# Altium schematic sheet [02] - Microcontroller.SchDoc: Microcontroller
size A3; Date: N.A.; ApprovedBy: N.A.; CheckedBy: N.A.; Author: N.A.; CompanyName: Johannes Berndorfer; DrawnBy: JBE; Organization: N.A.; Address1: Konrad Grefe Gasse 22; Address2: 1230 Wien; Address3: AUSTRIA; Address4: N.A.; DocumentNumber: 2; Revision: A; SheetNumber: 2; SheetTotal: 3; ProjectTitle: IntelliModule-Alpha; Reviewer: -; Time: N.A.; ImagePath: N.A.; Application_BuildNumber: N.A.
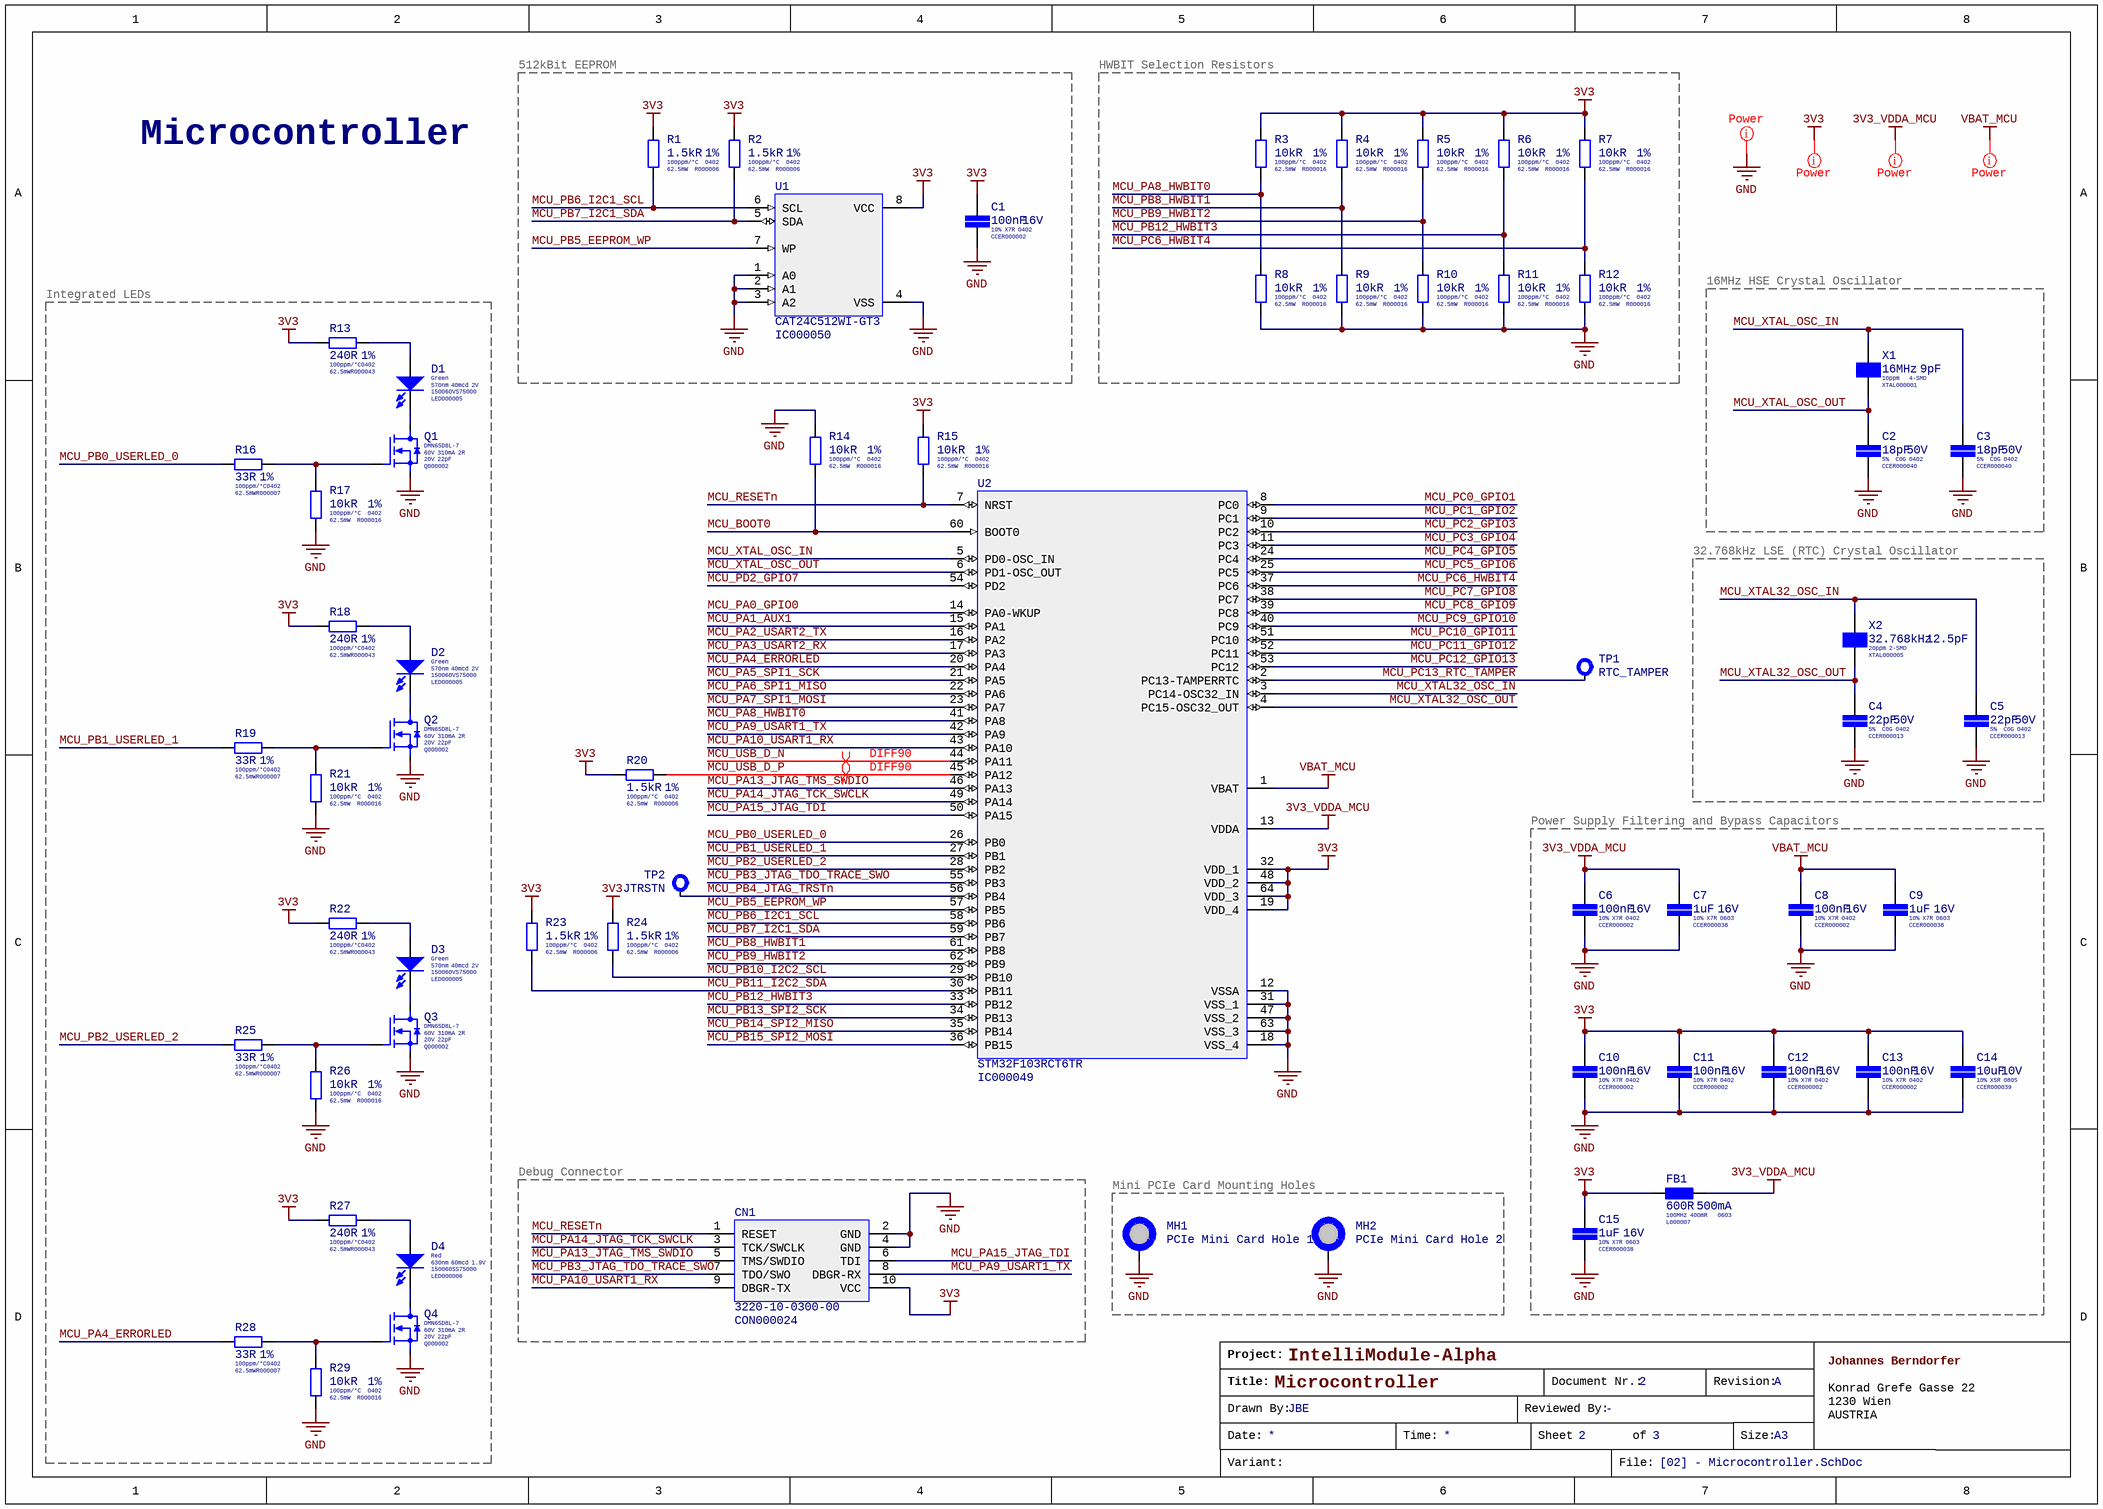
[diagram p0: [02] - Microcontroller.SchDoc]

## Parts
C1  Tolerance: 10%  Internal Part Number: CCER000002  Voltage Rating (DC): 16V  Dielectric: X7R  Case/Package: 0402  Capacitance: 100nF  [CAP-SMD-0402-0.55MM-IPC-MED]  (hidden comment: 100nF 16V)
C2  Internal Part Number: CCER000040  Case/Package: 0402  Dielectric: C0G  Tolerance: 5%  Voltage Rating: 50V  Capacitance: 18pF  [CAP-SMD-0402-0.55MM-IPC-MED]  (hidden comment: 18pF 50V)
C3  Internal Part Number: CCER000040  Case/Package: 0402  Dielectric: C0G  Tolerance: 5%  Voltage Rating: 50V  Capacitance: 18pF  [CAP-SMD-0402-0.55MM-IPC-MED]  (hidden comment: 18pF 50V)
C4  Internal Part Number: CCER000013  Voltage Rating: 50V  Tolerance: 5%  Dielectric: C0G  Case/Package: 0402  Capacitance: 22pF  [CAP-SMD-0402-0.55MM-IPC-MED]  (hidden comment: 22pF 50V)
C5  Internal Part Number: CCER000013  Voltage Rating: 50V  Tolerance: 5%  Dielectric: C0G  Case/Package: 0402  Capacitance: 22pF  [CAP-SMD-0402-0.55MM-IPC-MED]  (hidden comment: 22pF 50V)
C6  Tolerance: 10%  Internal Part Number: CCER000002  Voltage Rating (DC): 16V  Dielectric: X7R  Case/Package: 0402  Capacitance: 100nF  [CAP-SMD-0402-0.55MM-IPC-MED]  (hidden comment: 100nF 16V)
C7  Internal Part Number: CCER000038  Capacitance: 1uF  Voltage: 16V  Tolerance: 10%  Dielectric: X7R  Case/Package: 0603  [CAP-SMD-0603-0.9MM-IPC-MED]  (hidden comment: 1uF 16V)
C8  Tolerance: 10%  Internal Part Number: CCER000002  Voltage Rating (DC): 16V  Dielectric: X7R  Case/Package: 0402  Capacitance: 100nF  [CAP-SMD-0402-0.55MM-IPC-MED]  (hidden comment: 100nF 16V)
C9  Internal Part Number: CCER000038  Capacitance: 1uF  Voltage: 16V  Tolerance: 10%  Dielectric: X7R  Case/Package: 0603  [CAP-SMD-0603-0.9MM-IPC-MED]  (hidden comment: 1uF 16V)
C10  Tolerance: 10%  Internal Part Number: CCER000002  Voltage Rating (DC): 16V  Dielectric: X7R  Case/Package: 0402  Capacitance: 100nF  [CAP-SMD-0402-0.55MM-IPC-MED]  (hidden comment: 100nF 16V)
C11  Tolerance: 10%  Internal Part Number: CCER000002  Voltage Rating (DC): 16V  Dielectric: X7R  Case/Package: 0402  Capacitance: 100nF  [CAP-SMD-0402-0.55MM-IPC-MED]  (hidden comment: 100nF 16V)
C12  Tolerance: 10%  Internal Part Number: CCER000002  Voltage Rating (DC): 16V  Dielectric: X7R  Case/Package: 0402  Capacitance: 100nF  [CAP-SMD-0402-0.55MM-IPC-MED]  (hidden comment: 100nF 16V)
C13  Tolerance: 10%  Internal Part Number: CCER000002  Voltage Rating (DC): 16V  Dielectric: X7R  Case/Package: 0402  Capacitance: 100nF  [CAP-SMD-0402-0.55MM-IPC-MED]  (hidden comment: 100nF 16V)
C14  Internal Part Number: CCER000039  Tolerance: 10%  Voltage Rating: 10V  Dielectric: X5R  Case/Package: 0805  Capacitance: 10uF  [CAP-SMD-0805-1.35MM-IPC-MED]  (hidden comment: 10uF 10V)
C15  Internal Part Number: CCER000038  Capacitance: 1uF  Voltage: 16V  Tolerance: 10%  Dielectric: X7R  Case/Package: 0603  [CAP-SMD-0603-0.9MM-IPC-MED]  (hidden comment: 1uF 16V)
CN1  3220-10-0300-00  Internal Part Number: CON000024  [CON-SMD-PINHEADER-SHIELDED-1.27MM-10POS-2X5-3220-10-0300-00-CNC-TECH]
D1  Luminous Intensity: 40mcd  Forward Voltage: 2V  Color: Green  Wavelength: 570nm  Internal Part Number: LED000005  [LED-SMD-0603]  (hidden comment: 150060VS75000)
D2  Luminous Intensity: 40mcd  Forward Voltage: 2V  Color: Green  Wavelength: 570nm  Internal Part Number: LED000005  [LED-SMD-0603]  (hidden comment: 150060VS75000)
D3  Luminous Intensity: 40mcd  Forward Voltage: 2V  Color: Green  Wavelength: 570nm  Internal Part Number: LED000005  [LED-SMD-0603]  (hidden comment: 150060VS75000)
D4  Internal Part Number: LED000006  Luminous Intensity: 60mcd  Forward Voltage: 1.9V  Dominant Wavelength: 630nm  Color: Red  [LED-SMD-0603]  (hidden comment: 150060SS75000)
FB1  Internal Part Number: L000007  Max DC Current: 500mA  Impedance: 600R  DC Resistance (DCR): 400mR  Case/Package: 0603  [IND-SMD-0603-0.75MM-IPC-MED]  (hidden comment: 600R-100MHz 500MA)
MH1  PCIe Mini Card Hole 1  [MECH-HOLE-PTH-2.6MM-5.8MMSQ-PCIEMINI]
MH2  PCIe Mini Card Hole 2  [MECH-HOLE-PTH-2.6MM-5.8MMSQ-PCIEMINI]
Q1  Drain to Source Resistance: 2R  Continuous Drain Current (ID): 310mA  Drain to Source Breakdown Voltage: 60V  Gate to Source Voltage (Vgs): 20V  Input Capacitance: 22pF  Internal Part Number: Q000002  [SOT-23-3-H1.1MM-DIODES-INC]  (hidden comment: DMN65D8L-7)
Q2  Drain to Source Resistance: 2R  Continuous Drain Current (ID): 310mA  Drain to Source Breakdown Voltage: 60V  Gate to Source Voltage (Vgs): 20V  Input Capacitance: 22pF  Internal Part Number: Q000002  [SOT-23-3-H1.1MM-DIODES-INC]  (hidden comment: DMN65D8L-7)
Q3  Drain to Source Resistance: 2R  Continuous Drain Current (ID): 310mA  Drain to Source Breakdown Voltage: 60V  Gate to Source Voltage (Vgs): 20V  Input Capacitance: 22pF  Internal Part Number: Q000002  [SOT-23-3-H1.1MM-DIODES-INC]  (hidden comment: DMN65D8L-7)
Q4  Drain to Source Resistance: 2R  Continuous Drain Current (ID): 310mA  Drain to Source Breakdown Voltage: 60V  Gate to Source Voltage (Vgs): 20V  Input Capacitance: 22pF  Internal Part Number: Q000002  [SOT-23-3-H1.1MM-DIODES-INC]  (hidden comment: DMN65D8L-7)
R1  Temperature Coefficient: 100ppm/°C  Tolerance: 1%  Resistance: 1.5kR  Max Power Dissipation: 62.5mW  Case/Package: 0402  Internal Part Number: R000006  [RES-SMD-0402-0.4MM-IPC-MED]  (hidden comment: 1.5kR 1%)
R2  Temperature Coefficient: 100ppm/°C  Tolerance: 1%  Resistance: 1.5kR  Max Power Dissipation: 62.5mW  Case/Package: 0402  Internal Part Number: R000006  [RES-SMD-0402-0.4MM-IPC-MED]  (hidden comment: 1.5kR 1%)
R3  Tolerance: 1%  Temperature Coefficient: 100ppm/°C  Resistance: 10kR  Power Rating: 62.5mW  Case Code (Imperial): 0402  Internal Part Number: R000016  [RES-SMD-0402-0.4MM-IPC-MED]  (hidden comment: 10kR 1%)
R4  Tolerance: 1%  Temperature Coefficient: 100ppm/°C  Resistance: 10kR  Power Rating: 62.5mW  Case Code (Imperial): 0402  Internal Part Number: R000016  [RES-SMD-0402-0.4MM-IPC-MED]  (hidden comment: 10kR 1%)
R5  Tolerance: 1%  Temperature Coefficient: 100ppm/°C  Resistance: 10kR  Power Rating: 62.5mW  Case Code (Imperial): 0402  Internal Part Number: R000016  [RES-SMD-0402-0.4MM-IPC-MED]  (hidden comment: 10kR 1%)
R6  Tolerance: 1%  Temperature Coefficient: 100ppm/°C  Resistance: 10kR  Power Rating: 62.5mW  Case Code (Imperial): 0402  Internal Part Number: R000016  [RES-SMD-0402-0.4MM-IPC-MED]  (hidden comment: 10kR 1%)
R7  Tolerance: 1%  Temperature Coefficient: 100ppm/°C  Resistance: 10kR  Power Rating: 62.5mW  Case Code (Imperial): 0402  Internal Part Number: R000016  [RES-SMD-0402-0.4MM-IPC-MED]  (hidden comment: 10kR 1%)
R8  Tolerance: 1%  Temperature Coefficient: 100ppm/°C  Resistance: 10kR  Power Rating: 62.5mW  Case Code (Imperial): 0402  Internal Part Number: R000016  [RES-SMD-0402-0.4MM-IPC-MED]  (hidden comment: 10kR 1%)
R9  Tolerance: 1%  Temperature Coefficient: 100ppm/°C  Resistance: 10kR  Power Rating: 62.5mW  Case Code (Imperial): 0402  Internal Part Number: R000016  [RES-SMD-0402-0.4MM-IPC-MED]  (hidden comment: 10kR 1%)
R10  Tolerance: 1%  Temperature Coefficient: 100ppm/°C  Resistance: 10kR  Power Rating: 62.5mW  Case Code (Imperial): 0402  Internal Part Number: R000016  [RES-SMD-0402-0.4MM-IPC-MED]  (hidden comment: 10kR 1%)
R11  Tolerance: 1%  Temperature Coefficient: 100ppm/°C  Resistance: 10kR  Power Rating: 62.5mW  Case Code (Imperial): 0402  Internal Part Number: R000016  [RES-SMD-0402-0.4MM-IPC-MED]  (hidden comment: 10kR 1%)
R12  Tolerance: 1%  Temperature Coefficient: 100ppm/°C  Resistance: 10kR  Power Rating: 62.5mW  Case Code (Imperial): 0402  Internal Part Number: R000016  [RES-SMD-0402-0.4MM-IPC-MED]  (hidden comment: 10kR 1%)
R13  Resistance: 240R  Tolerance: 1%  Temperature Coefficient: 100ppm/°C  Power Rating: 62.5mW  Case/Package: 0402  Internal Part Number: R000043  [RES-SMD-0402-0.4MM-IPC-MED]  (hidden comment: 240R 1%)
R14  Tolerance: 1%  Temperature Coefficient: 100ppm/°C  Resistance: 10kR  Power Rating: 62.5mW  Case Code (Imperial): 0402  Internal Part Number: R000016  [RES-SMD-0402-0.4MM-IPC-MED]  (hidden comment: 10kR 1%)
R15  Tolerance: 1%  Temperature Coefficient: 100ppm/°C  Resistance: 10kR  Power Rating: 62.5mW  Case Code (Imperial): 0402  Internal Part Number: R000016  [RES-SMD-0402-0.4MM-IPC-MED]  (hidden comment: 10kR 1%)
R16  Internal Part Number: R000007  Temperature Coefficient: 100ppm/°C  Case/Package: 0402  Power Rating: 62.5mW  Tolerance: 1%  Resistance: 33R  [RES-SMD-0402-0.4MM-IPC-MED]  (hidden comment: 33R 1%)
R17  Tolerance: 1%  Temperature Coefficient: 100ppm/°C  Resistance: 10kR  Power Rating: 62.5mW  Case Code (Imperial): 0402  Internal Part Number: R000016  [RES-SMD-0402-0.4MM-IPC-MED]  (hidden comment: 10kR 1%)
R18  Resistance: 240R  Tolerance: 1%  Temperature Coefficient: 100ppm/°C  Power Rating: 62.5mW  Case/Package: 0402  Internal Part Number: R000043  [RES-SMD-0402-0.4MM-IPC-MED]  (hidden comment: 240R 1%)
R19  Internal Part Number: R000007  Temperature Coefficient: 100ppm/°C  Case/Package: 0402  Power Rating: 62.5mW  Tolerance: 1%  Resistance: 33R  [RES-SMD-0402-0.4MM-IPC-MED]  (hidden comment: 33R 1%)
R20  Temperature Coefficient: 100ppm/°C  Tolerance: 1%  Resistance: 1.5kR  Max Power Dissipation: 62.5mW  Case/Package: 0402  Internal Part Number: R000006  [RES-SMD-0402-0.4MM-IPC-MED]  (hidden comment: 1.5kR 1%)
R21  Tolerance: 1%  Temperature Coefficient: 100ppm/°C  Resistance: 10kR  Power Rating: 62.5mW  Case Code (Imperial): 0402  Internal Part Number: R000016  [RES-SMD-0402-0.4MM-IPC-MED]  (hidden comment: 10kR 1%)
R22  Resistance: 240R  Tolerance: 1%  Temperature Coefficient: 100ppm/°C  Power Rating: 62.5mW  Case/Package: 0402  Internal Part Number: R000043  [RES-SMD-0402-0.4MM-IPC-MED]  (hidden comment: 240R 1%)
R23  Temperature Coefficient: 100ppm/°C  Tolerance: 1%  Resistance: 1.5kR  Max Power Dissipation: 62.5mW  Case/Package: 0402  Internal Part Number: R000006  [RES-SMD-0402-0.4MM-IPC-MED]  (hidden comment: 1.5kR 1%)
R24  Temperature Coefficient: 100ppm/°C  Tolerance: 1%  Resistance: 1.5kR  Max Power Dissipation: 62.5mW  Case/Package: 0402  Internal Part Number: R000006  [RES-SMD-0402-0.4MM-IPC-MED]  (hidden comment: 1.5kR 1%)
R25  Internal Part Number: R000007  Temperature Coefficient: 100ppm/°C  Case/Package: 0402  Power Rating: 62.5mW  Tolerance: 1%  Resistance: 33R  [RES-SMD-0402-0.4MM-IPC-MED]  (hidden comment: 33R 1%)
R26  Tolerance: 1%  Temperature Coefficient: 100ppm/°C  Resistance: 10kR  Power Rating: 62.5mW  Case Code (Imperial): 0402  Internal Part Number: R000016  [RES-SMD-0402-0.4MM-IPC-MED]  (hidden comment: 10kR 1%)
R27  Resistance: 240R  Tolerance: 1%  Temperature Coefficient: 100ppm/°C  Power Rating: 62.5mW  Case/Package: 0402  Internal Part Number: R000043  [RES-SMD-0402-0.4MM-IPC-MED]  (hidden comment: 240R 1%)
R28  Internal Part Number: R000007  Temperature Coefficient: 100ppm/°C  Case/Package: 0402  Power Rating: 62.5mW  Tolerance: 1%  Resistance: 33R  [RES-SMD-0402-0.4MM-IPC-MED]  (hidden comment: 33R 1%)
R29  Tolerance: 1%  Temperature Coefficient: 100ppm/°C  Resistance: 10kR  Power Rating: 62.5mW  Case Code (Imperial): 0402  Internal Part Number: R000016  [RES-SMD-0402-0.4MM-IPC-MED]  (hidden comment: 10kR 1%)
TP1  RTC_TAMPER  [TP-SMD-CIRCULAR-0.5MM]
TP2  JTRSTN  [TP-SMD-CIRCULAR-0.5MM]
U1  CAT24C512WI-GT3  Internal Part Number: IC000050  [SOIC-8-H1.75MM-P1.27MM-ONSEMI]
U2  STM32F103RCT6TR  Internal Part Number: IC000049  [LQFP-64-10X10MM-H1.6MM-P0.5MM-ST]
X1  Case/Package: 4-SMD  Internal Part Number: XTAL000001  Frequency Tolerance: 10ppm  Load Capacitance: 9pF  Frequency: 16MHz  [XTAL-SMD-4-SMD-3.2X2.5MM]  (hidden comment: 16MHz 9pF)
X2  Internal Part Number: XTAL000005  Case/Package: 2-SMD  Frequency Tolerance: 20ppm  Load Capacitance: 12.5pF  Frequency: 32.768kHz  [XTAL-SMD-2-SMD-3.2X1.5MM]  (hidden comment: 32.768kHz 12.5pF)

## Blocks framed on the sheet
512kBit EEPROM: C1 R1 R2 U1
HWBIT Selection Resistors: R3-R12
Integrated LEDs: D1-D4 Q1-Q4 R13 R16-R19 R21 R22 R25-R29
16MHz HSE Crystal Oscillator: C2 C3 X1
32.768kHz LSE (RTC) Crystal Oscillator: C4 C5 X2
Power Supply Filtering and Bypass Capacitors: C6-C15 FB1
Debug Connector: CN1
Mini PCIe Card Mounting Holes: MH1 MH2

## Nets
3V3: C1.1 C10.1 C11.1 C12.1 C13.1 C14.1 C15.1 CN1.10(VCC) FB1.1 R1.1 R2.1 R3.1 R4.1 R5.1 R6.1 R7.1 R13.1 R15.1 R18.1 R20.1 R22.1 R23.1 R24.1 R27.1 U1.8(VCC) U2.19(VDD_4) U2.32(VDD_1) U2.48(VDD_2) U2.64(VDD_3)
3V3_VDDA_MCU: C6.1 C7.1 FB1.2 U2.13(VDDA)
GND: C1.2 C2.2 C3.2 C4.2 C5.2 C6.2 C7.2 C8.2 C9.2 C10.2 C11.2 C12.2 C13.2 C14.2 C15.2 CN1.2(GND) CN1.4(GND) MH1.1 MH2.1 Q1.2(Source) Q2.2(Source) Q3.2(Source) Q4.2(Source) R8.2 R9.2 R10.2 R11.2 R12.2 R14.1 R17.2 R21.2 R26.2 R29.2 U1.1(A0) U1.2(A1) U1.3(A2) U1.4(VSS) U2.12(VSSA) U2.18(VSS_4) U2.31(VSS_1) U2.47(VSS_2) U2.63(VSS_3)
VBAT_MCU: C8.1 C9.1 U2.1(VBAT)
MCU_BOOT0: R14.2 U2.60(BOOT0)
MCU_PA0_GPIO0: U2.14(PA0-WKUP)
MCU_PA1_AUX1: U2.15(PA1)
MCU_PA2_USART2_TX: U2.16(PA2)
MCU_PA3_USART2_RX: U2.17(PA3)
MCU_PA4_ERRORLED: R28.1 U2.20(PA4)
MCU_PA5_SPI1_SCK: U2.21(PA5)
MCU_PA6_SPI1_MISO: U2.22(PA6)
MCU_PA7_SPI1_MOSI: U2.23(PA7)
MCU_PA8_HWBIT0: R3.2 R8.1 U2.41(PA8)
MCU_PA9_USART1_TX: CN1.8(DBGR-RX) U2.42(PA9)
MCU_PA10_USART1_RX: CN1.9(DBGR-TX) U2.43(PA10)
MCU_PA13_JTAG_TMS_SWDIO: CN1.5(TMS/SWDIO) U2.46(PA13)
MCU_PA14_JTAG_TCK_SWCLK: CN1.3(TCK/SWCLK) U2.49(PA14)
MCU_PA15_JTAG_TDI: CN1.6(TDI) U2.50(PA15)
MCU_PB0_USERLED_0: R16.1 U2.26(PB0)
MCU_PB1_USERLED_1: R19.1 U2.27(PB1)
MCU_PB2_USERLED_2: R25.1 U2.28(PB2)
MCU_PB3_JTAG_TDO_TRACE_SWO: CN1.7(TDO/SWO) U2.55(PB3)
MCU_PB4_JTAG_TRSTn: TP2.1 U2.56(PB4)
MCU_PB5_EEPROM_WP: U1.7(WP) U2.57(PB5)
MCU_PB6_I2C1_SCL: R1.2 U1.6(SCL) U2.58(PB6)
MCU_PB7_I2C1_SDA: R2.2 U1.5(SDA) U2.59(PB7)
MCU_PB8_HWBIT1: R4.2 R9.1 U2.61(PB8)
MCU_PB9_HWBIT2: R5.2 R10.1 U2.62(PB9)
MCU_PB10_I2C2_SCL: R24.2 U2.29(PB10)
MCU_PB11_I2C2_SDA: R23.2 U2.30(PB11)
MCU_PB12_HWBIT3: R6.2 R11.1 U2.33(PB12)
MCU_PB13_SPI2_SCK: U2.34(PB13)
MCU_PB14_SPI2_MISO: U2.35(PB14)
MCU_PB15_SPI2_MOSI: U2.36(PB15)
MCU_PC0_GPIO1: U2.8(PC0)
MCU_PC1_GPIO2: U2.9(PC1)
MCU_PC2_GPIO3: U2.10(PC2)
MCU_PC3_GPIO4: U2.11(PC3)
MCU_PC4_GPIO5: U2.24(PC4)
MCU_PC5_GPIO6: U2.25(PC5)
MCU_PC6_HWBIT4: R7.2 R12.1 U2.37(PC6)
MCU_PC7_GPIO8: U2.38(PC7)
MCU_PC8_GPIO9: U2.39(PC8)
MCU_PC9_GPIO10: U2.40(PC9)
MCU_PC10_GPIO11: U2.51(PC10)
MCU_PC11_GPIO12: U2.52(PC11)
MCU_PC12_GPIO13: U2.53(PC12)
MCU_PC13_RTC_TAMPER: TP1.1 U2.2(PC13-TAMPERRTC)
MCU_PD2_GPIO7: U2.54(PD2)
MCU_RESETn: CN1.1(RESET) R15.2 U2.7(NRST)
MCU_USB_D_N: U2.44(PA11)
MCU_USB_D_P: R20.2 U2.45(PA12)
MCU_XTAL32_OSC_IN: C5.1 U2.3(PC14-OSC32_IN) X2.1
MCU_XTAL32_OSC_OUT: C4.1 U2.4(PC15-OSC32_OUT) X2.2
MCU_XTAL_OSC_IN: C3.1 U2.5(PD0-OSC_IN) X1.1
MCU_XTAL_OSC_OUT: C2.1 U2.6(PD1-OSC_OUT) X1.3
NetD1_1: D1.1 Q1.3(Drain)
NetD1_2: D1.2 R13.2
NetD2_1: D2.1 Q2.3(Drain)
NetD2_2: D2.2 R18.2
NetD3_1: D3.1 Q3.3(Drain)
NetD3_2: D3.2 R22.2
NetD4_1: D4.1 Q4.3(Drain)
NetD4_2: D4.2 R27.2
NetQ1_1: Q1.1(Gate) R16.2 R17.1
NetQ2_1: Q2.1(Gate) R19.2 R21.1
NetQ3_1: Q3.1(Gate) R25.2 R26.1
NetQ4_1: Q4.1(Gate) R28.2 R29.1

## Layout directives
differential pair; differential pair class DIFF90: MCU_USB_D_N, MCU_USB_D_P
net class Power: 3V3, 3V3_VDDA_MCU, GND, VBAT_MCU

## Notes on the sheet
- Labels drawn without touching a wire or pin: 3V3, 3V3_VDDA_MCU, GND, VBAT_MCU
- Title:
- Project:
- Document Nr.:
- Revision:
- Date:
- Drawn By:
- Time:
- Reviewed By:
- Sheet
- of
- Size:
- A3
- Variant:
- File:
- (in symbol MMZ1608B601CTAH0) 100MHz

## Library data of the parts
C1 C6 C8 C10-C13 = CL05B104KO5NNNC: CAP CER 100N 16V X7R 10% SMD 0402 125C SAMSUNG; Material: Ceramic; Supplier 1: Digi-Key; Manufacturer 1: Samsung; Manufacturer Part Number 1: CL05B104KO5NNNC; Stock 1: 53930414; Pricing 1: 1=0,10000, 10=0,02400, 100=0,01070, 500=0,00766, 1000=0,00602, 2500=0,00548, 5000=0,00504 (USD); RoHS: Yes; Mount: Surface Mount; Case Code (Metric): 1005; Case Code (Imperial): 0402; Contact Plating: Tin; Min Operating Temperature: -55°C; Max Operating Temperature: 125°C; Package Quantity: 1; Packaging: Tape and Reel; Voltage Rating: 16V; Voltage: 16V; Length: 1mm; Height: 0.5mm; Width: 0.02inch; Thickness: 0.022inch; Depth: 0.5mm; Radiation Hardening: No; Lead Free: Lead Free; ComponentLink1URL: https://datasheet.ciiva.com/26920/getdatasheetpartid-359683-26920169.pdf?src-supplier=Verical; ComponentLink1Description: https://datasheet.ciiva.com/26920/getdatasheetpartid-359683-26920169.pdf?src-supplier=Verical; ComponentLink2URL: https://datasheet.ciiva.com/29198/458718-da-01-en-vs-kondensator-0402-29198423.pdf?src-supplier=Conrad; ComponentLink2Description: https://datasheet.ciiva.com/29198/458718-da-01-en-vs-kondensator-0402-29198423.pdf?src-supplier=Conrad; ComponentLink3URL: https://datasheet.ciiva.com/16208/cl05b104kq5nnnc-16208343.pdf?src-supplier=Future+Electronics; ComponentLink3Description: https://datasheet.ciiva.com/16208/cl05b104kq5nnnc-16208343.pdf?src-supplier=Future+Electronics; ComponentLink4URL: https://datasheet.ciiva.com/26309/mlcc-catalogdownload2013-eng-26309003.pdf?src-supplier=Distrelec; ComponentLink4Description: https://datasheet.ciiva.com/26309/mlcc-catalogdownload2013-eng-26309003.pdf?src-supplier=Distrelec; Supplier Part Number 1: 1276-1001-6-ND
C2 C3 = CC0402JRNPO9BN180: CAP CER 18P 50V C0G 5% SMD 0402 125C YAGEO; Temperature Coefficient: 30ppm/°C; Supplier 1: Digi-Key; Manufacturer 1: Yageo; Manufacturer Part Number 1: CC0402JRNPO9BN180; Stock 1: 608594; Pricing 1: 1=0,10000, 10=0,02400, 100=0,01070, 500=0,00764, 1000=0,00601, 2500=0,00546, 5000=0,00502 (USD); RoHS: Yes; Mount: Surface Mount; Number of Pins: 2; Weight: 2.3E-05oz; Case Code (Metric): 1005; Case Code (Imperial): 0402; Min Operating Temperature: -55°C; Max Operating Temperature: 125°C; Packaging: Tape and Reel; Package Quantity: 1; Voltage Rating (DC): 50V; Termination: SMD/SMT; Composition: Ceramic; Voltage: 50V; Length: 1mm; Height: 0.5mm; Width: 0.02inch; Thickness: 0.022inch; Depth: 0.5mm; Radiation Hardening: No; REACH SVHC: No SVHC; Lead Free: Lead Free; ComponentLink1URL: https://datasheet.ciiva.com/11788/0900766b80d84fbf-11788369.pdf?src-supplier=RSComponents; ComponentLink1Description: https://datasheet.ciiva.com/11788/0900766b80d84fbf-11788369.pdf?src-supplier=RSComponents; ComponentLink2URL: https://datasheet.ciiva.com/176/mlccorderingcode-176358.pdf?src-supplier=Digi-Key; ComponentLink2Description: https://datasheet.ciiva.com/176/mlccorderingcode-176358.pdf?src-supplier=Digi-Key; ComponentLink3URL: https://datasheet.ciiva.com/176/mlccorderingcode-176359.pdf?src-supplier=Digi-Key; ComponentLink3Description: https://datasheet.ciiva.com/176/mlccorderingcode-176359.pdf?src-supplier=Digi-Key; ComponentLink4URL: https://datasheet.ciiva.com/11587/upy-gp-np0-16v-to-50v-8-11587087.pdf?src-supplier=Avnet; ComponentLink4Description: https://datasheet.ciiva.com/11587/upy-gp-np0-16v-to-50v-8-11587087.pdf?src-supplier=Avnet; ComponentLink5URL: https://datasheet.ciiva.com/176/mlccorderingcode-176357.pdf?src-supplier=Digi-Key; ComponentLink5Description: https://datasheet.ciiva.com/176/mlccorderingcode-176357.pdf?src-supplier=Digi-Key; ComponentLink6URL: https://datasheet.ciiva.com/28450/1443161-28450232.pdf?src-supplier=Element14; ComponentLink6Description: https://datasheet.ciiva.com/28450/1443161-28450232.pdf?src-supplier=Element14; ComponentLink7URL: https://datasheet.ciiva.com/13208/upy-gp-np0-16v-to-50v-8-13208430.pdf?src-supplier=Mouser; ComponentLink7Description: https://datasheet.ciiva.com/13208/upy-gp-np0-16v-to-50v-8-13208430.pdf?src-supplier=Mouser; Supplier Part Number 1: 311-1415-1-ND
C4 C5 = CL05C220JB5NNNC: CAP CER 22P 50V C0G 5% SMD 0402 125C SAMSUNG; Material: Ceramic; Temperature Coefficient: 300ppm/°C; Supplier 1: Digi-Key; Manufacturer: Samsung; Manufacturer Part Number: CL05C220JB5NNNC; Stock 1: 1663917; Pricing 1: 1 = 0,10000, 10 = 0,03300, 100 = 0,01480, 500 = 0,01058, 1000 = 0,00831, 2500 = 0,00755, 5000 = 0,00695 (USD); RoHS: Yes; Mount: Surface Mount; Case Code (Metric): 1005; Case Code (Imperial): 0402; Contact Plating: Tin; Min Operating Temperature: -55°C; Max Operating Temperature: 125°C; Package Quantity: 1; Packaging: Tape and Reel; Voltage: 50V; Length: 1mm; Height: 0.5mm; Width: 0.02inch; Thickness: 0.022inch; Depth: 0.5mm; Radiation Hardening: No; ComponentLink1URL: https://datasheet.ciiva.com/15195/getdatasheetpartid-358448-15195679.pdf?src-supplier=Verical; ComponentLink1Description: https://datasheet.ciiva.com/15195/getdatasheetpartid-358448-15195679.pdf?src-supplier=Verical; ComponentLink2URL: https://datasheet.ciiva.com/29198/458663-da-01-en-vs-kondensator-0402-29198414.pdf?src-supplier=Conrad; ComponentLink2Description: https://datasheet.ciiva.com/29198/458663-da-01-en-vs-kondensator-0402-29198414.pdf?src-supplier=Conrad; ComponentLink3URL: https://datasheet.ciiva.com/16199/cl05b104kq5nnnc-16199080.pdf?src-supplier=Future+Electronics; ComponentLink3Description: https://datasheet.ciiva.com/16199/cl05b104kq5nnnc-16199080.pdf?src-supplier=Future+Electronics; ComponentLink4URL: https://datasheet.ciiva.com/26309/mlcc-catalogdownload2013-eng-26309032.pdf?src-supplier=Distrelec; ComponentLink4Description: https://datasheet.ciiva.com/26309/mlcc-catalogdownload2013-eng-26309032.pdf?src-supplier=Distrelec; Supplier Part Number 1: 1276-1116-1-ND
C7 C9 C15 = CL10B105KO8NNNC: CAP CER 1U 16V X7R 10% SMD 0603 125C SAMSUNG; Material: Ceramic; Supplier 1: Digi-Key; Manufacturer 1: Samsung; Manufacturer Part Number 1: CL10B105KO8NNNC; Stock 1: 4308120; Pricing 1: 1=0,10000, 10=0,05200, 100=0,02320, 500=0,01654, 1000=0,01300 (USD); RoHS: Yes; Mount: Surface Mount; Case Code (Metric): 1608; Case Code (Imperial): 0603; Min Operating Temperature: -55°C; Max Operating Temperature: 125°C; Packaging: Tape and Reel; Voltage Rating: 16V; Voltage Rating (DC): 16V; Length: 1.6mm; Height: 0.8mm; Width: 0.031inch; Thickness: 0.035inch; Depth: 0.8mm; Radiation Hardening: No; Lead Free: Lead Free; ComponentLink1URL: https://datasheet.ciiva.com/15195/getdatasheetpartid-357418-15195728.pdf?src-supplier=Verical; ComponentLink1Description: https://datasheet.ciiva.com/15195/getdatasheetpartid-357418-15195728.pdf?src-supplier=Verical; ComponentLink2URL: https://datasheet.ciiva.com/29198/458176-da-01-en-vs-kondensator-0603-29198478.pdf?src-supplier=Conrad; ComponentLink2Description: https://datasheet.ciiva.com/29198/458176-da-01-en-vs-kondensator-0603-29198478.pdf?src-supplier=Conrad; Supplier Part Number 1: 1276-1019-1-ND
C14 = CL21A106KPFNNNG: CAP CER 10U 10V X5R 10% SMD 0805 85C SAMSUNG; Supplier 1: Digi-Key; Manufacturer 1: Samsung; Manufacturer Part Number 1: CL21A106KPFNNNG; Stock 1: 884042; Pricing 1: 1=0,14000, 10=0,10000, 100=0,04690, 500=0,03290, 1000=0,02724 (USD); RoHS: Yes; Mount: Surface Mount; Case Code (Metric): 2012; Case Code (Imperial): 0805; Min Operating Temperature: -55°C; Max Operating Temperature: 85°C; Voltage: 10V; Packaging: Tape and Reel; Package Quantity: 3000; Termination: Wraparound; Length: 2mm; Height: 1.25mm; Depth: 1.25mm; Width: 0.049inch; Thickness: 0.053inch; Radiation Hardening: No; Lead Free: Lead Free; ComponentLink1URL: https://datasheet.ciiva.com/16428/cl21a106kpfnnng-16428896.pdf?src-supplier=Future+Electronics; ComponentLink1Description: https://datasheet.ciiva.com/16428/cl21a106kpfnnng-16428896.pdf?src-supplier=Future+Electronics; ComponentLink2URL: https://datasheet.ciiva.com/26936/getdatasheetpartid-640497-26936900.pdf?src-supplier=Verical; ComponentLink2Description: https://datasheet.ciiva.com/26936/getdatasheetpartid-640497-26936900.pdf?src-supplier=Verical; Supplier Part Number 1: 1276-6456-1-ND
CN1 = 3220-10-0300-00: CON PINHDR SMD 1.27MM SHIELDED KEYED CNC TECH 10POS; Number of Positions: 10; Connector Type: Male Pin; Pitch: 0.05inch; Supplier 1: Digi-Key; Manufacturer 1: CNC Tech; Manufacturer Part Number 1: 3220-10-0300-00; Stock 1: 107713; Pricing 1: 1=0,74000, 10=0,69000, 100=0,52900, 500=0,46000, 3200=0,34500, 6400=0,33350, 12800=0,30590 (USD); RoHS: Yes; Mount: Surface Mount; Contact Plating: Gold; Package Quantity: 3200; Number of Rows: 2; Packaging: Tray; Termination: Solder; Row Spacing: 0.05inch; ComponentLink1URL: https://datasheet.ciiva.com/18655/3220-xx-0300-00-18655365.pdf?src-supplier=Digi-Key; ComponentLink1Description: https://datasheet.ciiva.com/18655/3220-xx-0300-00-18655365.pdf?src-supplier=Digi-Key; Supplier Part Number 1: 1175-1629-ND
D1-D3 = 150060VS75000: LED GREEN570NM SMD 0603 2V 20mA 40mcd; Manufacturer: Wurth Electronics; Viewing Angle: 140°; Lens Style: Clear,Rectangular; Forward Current: 30mA; Supplier 1: Digi-Key; Stock 1: 94015; Pricing 1: 1 = 0,14000, 50 = 0,12900, 100 = 0,11000, 500 = 0,09500 (USD); RoHS: Yes; Mount: Surface Mount; Case/Package: 0603; Number of Pins: 2; Case Code (Metric): 1608; Case Code (Imperial): 0603; Min Operating Temperature: -40°C; Max Operating Temperature: 85°C; Package Quantity: 1; Packaging: Tape and Reel; Dominant Wavelength: 570nm; Test Current: 20mA; Length: 1.6mm; Height: 0.7mm; Width: 0.8mm; REACH SVHC: Unknown; ComponentLink1URL: https://datasheet.ciiva.com/23843/150060vs75000-23843249.pdf?src-supplier=Newark; ComponentLink1Description: https://datasheet.ciiva.com/23843/150060vs75000-23843249.pdf?src-supplier=Newark; ComponentLink2URL: https://datasheet.ciiva.com/29279/759431-da-01-en-chipled-0603-w-kl-h-gruen-150060vs7500-29279199.pdf?src-supplier=Conrad; ComponentLink2Description: https://datasheet.ciiva.com/29279/759431-da-01-en-chipled-0603-w-kl-h-gruen-150060vs7500-29279199.pdf?src-supplier=Conrad; ComponentLink3URL: https://datasheet.ciiva.com/29562/150060vs75000-29562919.pdf?src-supplier=Digi-Key; ComponentLink3Description: https://datasheet.ciiva.com/29562/150060vs75000-29562919.pdf?src-supplier=Digi-Key; ComponentLink4URL: https://datasheet.ciiva.com/29562/150060vs75000-29562920.pdf?src-supplier=Digi-Key; ComponentLink4Description: https://datasheet.ciiva.com/29562/150060vs75000-29562920.pdf?src-supplier=Digi-Key; ComponentLink5URL: https://datasheet.ciiva.com/29562/150060vs75000-29562921.pdf?src-supplier=Digi-Key; ComponentLink5Description: https://datasheet.ciiva.com/29562/150060vs75000-29562921.pdf?src-supplier=Digi-Key; ComponentLink6URL: https://datasheet.ciiva.com/48430/150060vs75000-eng-tds-48430043.pdf?src-supplier=Distrelec; ComponentLink6Description: https://datasheet.ciiva.com/48430/150060vs75000-eng-tds-48430043.pdf?src-supplier=Distrelec; Supplier Part Number 1: 732-4980-1-ND; Manufacturer Part Number: 150060VS75000
D4 = 150060SS75000: LED RED630NM SMD 0603 1V9 20mA 60mcd; Manufacturer: Wurth Electronics; Viewing Angle: 140°; Lens Style: Clear,Rectangular; Forward Current: 30mA; Supplier 1: Digi-Key; Stock 1: 15803; Pricing 1: 1 = 0,14000, 50 = 0,12900, 100 = 0,11000, 500 = 0,09500 (USD); RoHS: Yes; Mount: Surface Mount; Case/Package: 0603; Case Code (Metric): 1608; Case Code (Imperial): 0603; Min Operating Temperature: -40°C; Max Operating Temperature: 85°C; Package Quantity: 4000; Packaging: Tape and Reel; Wavelength: 630nm; Test Current: 20mA; Length: 1.6mm; Height: 0.7mm; Width: 0.8mm; REACH SVHC: Unknown; ComponentLink1URL: https://datasheet.ciiva.com/23843/150060ss75000-23843248.pdf?src-supplier=Newark; ComponentLink1Description: https://datasheet.ciiva.com/23843/150060ss75000-23843248.pdf?src-supplier=Newark; ComponentLink2URL: https://datasheet.ciiva.com/29279/759429-da-01-en-chipled-0603-w-kl-s-rot-150060ss75000-29279208.pdf?src-supplier=Conrad; ComponentLink2Description: https://datasheet.ciiva.com/29279/759429-da-01-en-chipled-0603-w-kl-s-rot-150060ss75000-29279208.pdf?src-supplier=Conrad; ComponentLink3URL: https://datasheet.ciiva.com/48430/150060ss75000-eng-tds-48430042.pdf?src-supplier=Distrelec; ComponentLink3Description: https://datasheet.ciiva.com/48430/150060ss75000-eng-tds-48430042.pdf?src-supplier=Distrelec; Supplier Part Number 1: 732-4979-1-ND; Manufacturer Part Number: 150060SS75000
FB1 = MMZ1608B601CTAH0: BEAD 600R@100MHZ 500MA 400mR SMD 0603 FERRITE TDK; Tolerance: 25%; Supplier 1: Digi-Key; Manufacturer 1: TDK; Manufacturer Part Number 1: MMZ1608B601CTAH0; Stock 1: 181107; Pricing 1: 1=0,10000, 10=0,07300, 25=0,06600, 50=0,05940, 100=0,04360, 250=0,03168, 500=0,02904, 1000=0,02508 (USD); RoHS: Yes; Mount: Surface Mount; Core Material: Ferrite; Case Code (Metric): 1608; Case Code (Imperial): 0603; Package Quantity: 1; Packaging: Cut Tape; Length: 0.063inch; Height: 0.03inch; Width: 0.031inch; Depth: 0.8mm; REACH SVHC: No SVHC; ComponentLink1URL: https://datasheet.ciiva.com/46381/714910-46381640.pdf?src-supplier=Element14; ComponentLink1Description: https://datasheet.ciiva.com/46381/714910-46381640.pdf?src-supplier=Element14; ComponentLink2URL: https://datasheet.ciiva.com/46634/beads-commercial-signal-mmz-en-46634744.pdf?src-supplier=Digi-Key; ComponentLink2Description: https://datasheet.ciiva.com/46634/beads-commercial-signal-mmz-en-46634744.pdf?src-supplier=Digi-Key; ComponentLink3URL: https://datasheet.ciiva.com/46634/beads-commercial-signal-mmz-en-46634701.pdf?src-supplier=Digi-Key; ComponentLink3Description: https://datasheet.ciiva.com/46634/beads-commercial-signal-mmz-en-46634701.pdf?src-supplier=Digi-Key; ComponentLink4URL: https://datasheet.ciiva.com/46381/1795294-46381695.pdf?src-supplier=Element14; ComponentLink4Description: https://datasheet.ciiva.com/46381/1795294-46381695.pdf?src-supplier=Element14; Supplier Part Number 1: 445-2166-1-ND; Current Rating: 500mA
MH1 MH2 = MECH-HOLE-PTH-2.6MM-5.8MMSQ-PCIEMINI: 2.6mm Diameter 5.8mm Square Pad Plated Through Hole for PCIe-Mini Cards
Q1-Q4 = DMN65D8L-7: TRANSISTOR MOSFET N-CH 60V 310mA 2R SOT-23; Manufacturer: Diodes; Rise Time: 2.8ns; Rds On Max: 3R; Max Power Dissipation: 370mW; Power Dissipation: 540mW; Turn-Off Delay Time: 12.6ns; Turn-On Delay Time: 2.7ns; Number of Elements: 1; Threshold Voltage: 2V; Element Configuration: Single; FET Type: 1 N-Channel; Supplier 1: Digi-Key; Stock 1: 1242871; Pricing 1: 1 = 0,17000, 10 = 0,15400, 100 = 0,08390, 500 = 0,05166, 1000 = 0,03522 (USD); RoHS: Yes; Mount: Surface Mount; Case/Package: SOT-23; Number of Pins: 3; Weight: 0.000282oz; Min Operating Temperature: -55°C; Max Operating Temperature: 150°C; Packaging: Tape and Reel; Package Quantity: 1; Drain to Source Voltage (Vdss): 60V; Number of Channels: 1; Length: 3mm; Height: 1.1mm; Width: 1.4mm; REACH SVHC: No SVHC; Lead Free: Lead Free; ComponentLink1URL: https://datasheet.ciiva.com/6371/dmn65d8l-6371124.pdf?src-supplier=Digi-Key; ComponentLink1Description: https://datasheet.ciiva.com/6371/dmn65d8l-6371124.pdf?src-supplier=Digi-Key; ComponentLink2URL: https://datasheet.ciiva.com/13058/dmn65d8l-219098-13058455.pdf?src-supplier=Mouser; ComponentLink2Description: https://datasheet.ciiva.com/13058/dmn65d8l-219098-13058455.pdf?src-supplier=Mouser; ComponentLink3URL: https://datasheet.ciiva.com/6371/dmn65d8l-6371126.pdf?src-supplier=Digi-Key; ComponentLink3Description: https://datasheet.ciiva.com/6371/dmn65d8l-6371126.pdf?src-supplier=Digi-Key; ComponentLink4URL: https://datasheet.ciiva.com/6371/dmn65d8l-6371128.pdf?src-supplier=Digi-Key; ComponentLink4Description: https://datasheet.ciiva.com/6371/dmn65d8l-6371128.pdf?src-supplier=Digi-Key; Supplier Part Number 1: DMN65D8L-7DICT-ND; Manufacturer Part Number: DMN65D8L-7
R1 R2 R20 R23 R24 = RC0402FR-071K5L: RES 1K5 1% 1/16W SMD 0402 YAEGO; Manufacturer: Yageo; Voltage Rating: 50V; Supplier 1: Digi-Key; Manufacturer Part Number: RC0402FR-071K5L; Stock 1: 9091318; Pricing 1: 1 = 0,10000, 10 = 0,01600, 100 = 0,00640, 1000 = 0,00286, 2500 = 0,00248, 5000 = 0,00205 (USD); RoHS: Yes; Case Code (Metric): 1005; Case Code (Imperial): 0402; Min Operating Temperature: -55°C; Max Operating Temperature: 155°C; Package Quantity: 1; Power Rating: 62.5mW; Packaging: Tape and Reel; Composition: Thick Film; Number of Terminations: 2; Termination: SMD/SMT; Military Standard: Not; Features: Moisture Resistant; Length: 1mm; Height: 0.016inch; Width: 0.02inch; Depth: 0.5mm; REACH SVHC: No SVHC; Lead Free: Lead Free; ComponentLink1URL: https://datasheet.ciiva.com/11808/0900766b80c66297-11808238.pdf?src-supplier=RSComponents; ComponentLink1Description: https://datasheet.ciiva.com/11808/0900766b80c66297-11808238.pdf?src-supplier=RSComponents; ComponentLink2URL: https://datasheet.ciiva.com/2453/pyu-r-int-thick-7-2453440.pdf?src-supplier=Digi-Key; ComponentLink2Description: https://datasheet.ciiva.com/2453/pyu-r-int-thick-7-2453440.pdf?src-supplier=Digi-Key; ComponentLink3URL: https://datasheet.ciiva.com/2453/pyu-r-int-thick-7-2453441.pdf?src-supplier=Digi-Key; ComponentLink3Description: https://datasheet.ciiva.com/2453/pyu-r-int-thick-7-2453441.pdf?src-supplier=Digi-Key; ComponentLink4URL: https://datasheet.ciiva.com/46394/1018594-46394950.pdf?src-supplier=Element14; ComponentLink4Description: https://datasheet.ciiva.com/46394/1018594-46394950.pdf?src-supplier=Element14; ComponentLink5URL: https://datasheet.ciiva.com/7849/1018594-7849864.pdf?src-supplier=Element14; ComponentLink5Description: https://datasheet.ciiva.com/7849/1018594-7849864.pdf?src-supplier=Element14; ComponentLink6URL: https://datasheet.ciiva.com/15189/getdatasheetpartid-323992-15189370.pdf?src-supplier=Verical; ComponentLink6Description: https://datasheet.ciiva.com/15189/getdatasheetpartid-323992-15189370.pdf?src-supplier=Verical; ComponentLink7URL: https://datasheet.ciiva.com/7849/1018594-7849863.pdf?src-supplier=Element14; ComponentLink7Description: https://datasheet.ciiva.com/7849/1018594-7849863.pdf?src-supplier=Element14; ComponentLink8URL: https://datasheet.ciiva.com/12558/pyu-rc0402-51-rohs-l-6-r-8721-12558542.pdf?src-supplier=Mouser; ComponentLink8Description: https://datasheet.ciiva.com/12558/pyu-rc0402-51-rohs-l-6-r-8721-12558542.pdf?src-supplier=Mouser; ComponentLink9URL: https://datasheet.ciiva.com/2453/pyu-r-int-thick-7-2453439.pdf?src-supplier=Digi-Key; ComponentLink9Description: https://datasheet.ciiva.com/2453/pyu-r-int-thick-7-2453439.pdf?src-supplier=Digi-Key; Supplier Part Number 1: 311-1.50KLRCT-ND
R3-R12 R14 R15 R17 R21 R26 R29 = RC0402FR-0710KL: RES 10K 1% 1/16W SMD 0402 YAEGO; Manufacturer: Yageo; Voltage Rating: 50V; Manufacturer Part Number: RC0402FR-0710KL; RoHS: Yes; Case/Package: 0402; Number of Pins: 2; Case Code (Metric): 1005; Min Operating Temperature: -55°C; Max Operating Temperature: 155°C; Packaging: Tape and Reel; Composition: Thick Film; Voltage Rating (DC): 50V; Termination: SMD/SMT; Military Standard: Not; Working Voltage: 50V; Number of Terminations: 2; Length: 1mm; Height: 0.32mm; Width: 0.5mm; Depth: 0.5mm; Lead Pitch: 0.2mm; REACH SVHC: No SVHC; Lead Free: Lead Free; ComponentLink1URL: https://datasheet.ciiva.com/7660/38568-7660787.pdf?src-supplier=Element14; ComponentLink1Description: https://datasheet.ciiva.com/7660/38568-7660787.pdf?src-supplier=Element14; ComponentLink2URL: https://datasheet.ciiva.com/7849/1784430-7849813.pdf?src-supplier=Element14; ComponentLink2Description: https://datasheet.ciiva.com/7849/1784430-7849813.pdf?src-supplier=Element14; ComponentLink3URL: https://datasheet.ciiva.com/7849/1686128-7849814.pdf?src-supplier=Element14; ComponentLink3Description: https://datasheet.ciiva.com/7849/1686128-7849814.pdf?src-supplier=Element14; ComponentLink4URL: https://datasheet.ciiva.com/7849/1784430-7849815.pdf?src-supplier=Element14; ComponentLink4Description: https://datasheet.ciiva.com/7849/1784430-7849815.pdf?src-supplier=Element14; ComponentLink5URL: https://datasheet.ciiva.com/22747/1018594-22747512.pdf?src-supplier=Element14; ComponentLink5Description: https://datasheet.ciiva.com/22747/1018594-22747512.pdf?src-supplier=Element14; ComponentLink6URL: https://datasheet.ciiva.com/12667/pyu-rc0402-51-rohs-l-6-r-12667067.pdf?src-supplier=Mouser; ComponentLink6Description: https://datasheet.ciiva.com/12667/pyu-rc0402-51-rohs-l-6-r-12667067.pdf?src-supplier=Mouser; ComponentLink7URL: https://datasheet.ciiva.com/7983/1018594-7983486.pdf?src-supplier=Element14; ComponentLink7Description: https://datasheet.ciiva.com/7983/1018594-7983486.pdf?src-supplier=Element14; Package Quantity: 10000; ComponentLink8URL: https://datasheet.ciiva.com/11819/0900766b80c66297-11819487.pdf?src-supplier=RSComponents; ComponentLink8Description: https://datasheet.ciiva.com/11819/0900766b80c66297-11819487.pdf?src-supplier=RSComponents; ComponentLink9URL: https://datasheet.ciiva.com/15189/getdatasheetpartid-329253-15189431.pdf?src-supplier=Verical; ComponentLink9Description: https://datasheet.ciiva.com/15189/getdatasheetpartid-329253-15189431.pdf?src-supplier=Verical; ComponentLink10URL: https://datasheet.ciiva.com/24070/pyu-rc0402-51-rohs-l-6-r-8721-24070077.pdf?src-supplier=Mouser; ComponentLink10Description: https://datasheet.ciiva.com/24070/pyu-rc0402-51-rohs-l-6-r-8721-24070077.pdf?src-supplier=Mouser; ComponentLink11URL: https://datasheet.ciiva.com/7849/1018594-7849966.pdf?src-supplier=Element14; ComponentLink11Description: https://datasheet.ciiva.com/7849/1018594-7849966.pdf?src-supplier=Element14; ComponentLink12URL: https://datasheet.ciiva.com/7849/1018594-7849967.pdf?src-supplier=Element14; ComponentLink12Description: https://datasheet.ciiva.com/7849/1018594-7849967.pdf?src-supplier=Element14; ComponentLink13URL: https://datasheet.ciiva.com/17070/pyu-rc0402-51-rohs-l-6-r-17070335.pdf?src-supplier=Future+Electronics; ComponentLink13Description: https://datasheet.ciiva.com/17070/pyu-rc0402-51-rohs-l-6-r-17070335.pdf?src-supplier=Future+Electronics; Supplier 1: Digi-Key; Stock 1: 86154015; Pricing 1: 1 = 0,10000, 10 = 0,01600, 100 = 0,00670, 1000 = 0,00301, 2500 = 0,00261, 5000 = 0,00215 (USD); Supplier Part Number 1: 311-10.0KLRCT-ND
R13 R18 R22 R27 = RC0402FR-07240RL: RES 240R 1% 1/16W SMD 0402 YAGEO; Manufacturer: Yageo Phycomp; Voltage Rating (DC): 50V; Supplier 1: Digi-Key; Manufacturer Part Number: RC0402FR-07240RL; Stock 1: 5684518; Pricing 1: 1 = 0,10000, 10 = 0,01600, 100 = 0,00670, 1000 = 0,00301, 2500 = 0,00261, 5000 = 0,00215 (USD); RoHS: Yes; Mount: Surface Mount; Number of Pins: 2; Min Operating Temperature: -55°C; Max Operating Temperature: 155°C; Packaging: Cut Tape; Length: 1mm; Height: 0.32mm; Depth: 0.5mm; REACH SVHC: No SVHC; Lead Free: Lead Free; ComponentLink1URL: http://www.mouser.com/ds/2/447/PYu-RC0402_51_RoHS_L_6_r-8721.pdf?src-supplier=Mouser; ComponentLink1Description: http://www.mouser.com/ds/2/447/PYu-RC0402_51_RoHS_L_6_r-8721.pdf?src-supplier=Mouser; ComponentLink2URL: http://www.farnell.com/datasheets/2167052.pdf?src-supplier=Farnell; ComponentLink2Description: http://www.farnell.com/datasheets/2167052.pdf?src-supplier=Farnell; ComponentLink3URL: http://www.yageo.com/documents/recent/PYu-RC_Group_51_RoHS_L_9.pdf?src-supplier=Digi-Key; ComponentLink3Description: http://www.yageo.com/documents/recent/PYu-RC_Group_51_RoHS_L_9.pdf?src-supplier=Digi-Key; ComponentLink4URL: http://www.yageo.com/documents/recent/PYu-RC_Group_51_RoHS_L_10.pdf?src-supplier=Digi-Key; ComponentLink4Description: http://www.yageo.com/documents/recent/PYu-RC_Group_51_RoHS_L_10.pdf?src-supplier=Digi-Key; ComponentLink5URL: http://www.farnell.com/datasheets/2167052.pdf?src-supplier=Element14; ComponentLink5Description: http://www.farnell.com/datasheets/2167052.pdf?src-supplier=Element14; Supplier Part Number 1: 311-240LRCT-ND
R16 R19 R25 R28 = RC0402FR-0733RL: RES 33R 1% 1/16W SMD 0402 YAEGO; Manufacturer: Yageo; Voltage Rating: 50V; Supplier 1: Digi-Key; Manufacturer Part Number: RC0402FR-0733RL; Stock 1: 6998295; Pricing 1: 1 = 0,10000, 10 = 0,01600, 100 = 0,00670, 1000 = 0,00301, 2500 = 0,00261, 5000 = 0,00215 (USD); RoHS: Yes; Number of Pins: 2; Case Code (Imperial): 0402; Case Code (Metric): 1005; Min Operating Temperature: -55°C; Max Operating Temperature: 155°C; Packaging: Tape and Reel; Termination: SMD/SMT; Composition: Thick Film; Military Standard: Not; Voltage Rating (DC): 50V; Package Quantity: 10000; Length: 1mm; Height: 0.35mm; Depth: 0.5mm; Width: 0.5mm; REACH SVHC: Unknown; Lead Free: Lead Free; ComponentLink1URL: https://datasheet.ciiva.com/11819/0900766b80c66297-11819487.pdf?src-supplier=RSComponents; ComponentLink1Description: https://datasheet.ciiva.com/11819/0900766b80c66297-11819487.pdf?src-supplier=RSComponents; ComponentLink2URL: https://datasheet.ciiva.com/15189/getdatasheetpartid-329253-15189431.pdf?src-supplier=Verical; ComponentLink2Description: https://datasheet.ciiva.com/15189/getdatasheetpartid-329253-15189431.pdf?src-supplier=Verical; ComponentLink3URL: https://datasheet.ciiva.com/24070/pyu-rc0402-51-rohs-l-6-r-8721-24070077.pdf?src-supplier=Mouser; ComponentLink3Description: https://datasheet.ciiva.com/24070/pyu-rc0402-51-rohs-l-6-r-8721-24070077.pdf?src-supplier=Mouser; ComponentLink4URL: https://datasheet.ciiva.com/7849/1018594-7849966.pdf?src-supplier=Element14; ComponentLink4Description: https://datasheet.ciiva.com/7849/1018594-7849966.pdf?src-supplier=Element14; ComponentLink5URL: https://datasheet.ciiva.com/7849/1018594-7849967.pdf?src-supplier=Element14; ComponentLink5Description: https://datasheet.ciiva.com/7849/1018594-7849967.pdf?src-supplier=Element14; ComponentLink6URL: https://datasheet.ciiva.com/17070/pyu-rc0402-51-rohs-l-6-r-17070335.pdf?src-supplier=Future+Electronics; ComponentLink6Description: https://datasheet.ciiva.com/17070/pyu-rc0402-51-rohs-l-6-r-17070335.pdf?src-supplier=Future+Electronics; Supplier Part Number 1: 311-33.0LRCT-ND
TP1 TP2 = TESTPOINT_CIRCULAR_0.5MM
U1 = CAT24C512WI-GT3: IC EEPROM 512KBIT 8BIT WORD I2C 1MHZ SOIC-8; Manufacturer: ON Semiconductor; Access Time: 3500ns; Max Supply Voltage: 5.5V; Min Supply Voltage: 1.8V; Interface: I2C,Serial,2-Wire; Nominal Supply Current: 2.5mA; Density: 512Kb; Number of Words: 64000; Operating Supply Voltage: 5V; Max Frequency: 400kHz; Supplier 1: Digi-Key; Manufacturer Part Number: CAT24C512WI-GT3; Stock 1: 31510; Pricing 1: 1 = 0,57000, 10 = 0,52400, 100 = 0,45980, 500 = 0,44922, 1000 = 0,43301 (USD); RoHS: Yes; Mount: Surface Mount; Case/Package: SOIC; Number of Pins: 8; Contact Plating: Gold; Min Operating Temperature: -40°C; Max Operating Temperature: 85°C; Package Quantity: 1; Packaging: Tape and Reel; Frequency: 1MHz; Memory Type: EEPROM; Memory Size: 512Kb; Length: 5mm; Height: 1.5mm; Width: 4mm; Radiation Hardening: No; REACH SVHC: No SVHC; Lead Free: Lead Free; Halogen Free: Halogen Free; ComponentLink1URL: https://datasheet.ciiva.com/4860/cat24c512-d-109024-4860160.pdf?src-supplier=Mouser; ComponentLink1Description: https://datasheet.ciiva.com/4860/cat24c512-d-109024-4860160.pdf?src-supplier=Mouser; ComponentLink2URL: https://datasheet.ciiva.com/22618/1674429-22618480.pdf?src-supplier=Element14; ComponentLink2Description: https://datasheet.ciiva.com/22618/1674429-22618480.pdf?src-supplier=Element14; ComponentLink3URL: https://datasheet.ciiva.com/25627/0900766b810de298-25627756.pdf?src-supplier=RSComponents; ComponentLink3Description: https://datasheet.ciiva.com/25627/0900766b810de298-25627756.pdf?src-supplier=RSComponents; ComponentLink4URL: https://datasheet.ciiva.com/1906/cat24c512-d-1906881.pdf?src-supplier=Digi-Key; ComponentLink4Description: https://datasheet.ciiva.com/1906/cat24c512-d-1906881.pdf?src-supplier=Digi-Key; ComponentLink5URL: https://datasheet.ciiva.com/3185/cat24c512-d-3185628.pdf?src-supplier=Avnet; ComponentLink5Description: https://datasheet.ciiva.com/3185/cat24c512-d-3185628.pdf?src-supplier=Avnet; ComponentLink6URL: https://datasheet.ciiva.com/9282/cat24c512-d-9282429.pdf?src-supplier=Avnet; ComponentLink6Description: https://datasheet.ciiva.com/9282/cat24c512-d-9282429.pdf?src-supplier=Avnet; ComponentLink7URL: https://datasheet.ciiva.com/16289/cat24c512-d-16289597.pdf?src-supplier=Future+Electronics; ComponentLink7Description: https://datasheet.ciiva.com/16289/cat24c512-d-16289597.pdf?src-supplier=Future+Electronics; ComponentLink8URL: https://datasheet.ciiva.com/1906/cat24c512-d-1906879.pdf?src-supplier=Digi-Key; ComponentLink8Description: https://datasheet.ciiva.com/1906/cat24c512-d-1906879.pdf?src-supplier=Digi-Key; ComponentLink9URL: https://datasheet.ciiva.com/1906/cat24c512-d-1906880.pdf?src-supplier=Digi-Key; ComponentLink9Description: https://datasheet.ciiva.com/1906/cat24c512-d-1906880.pdf?src-supplier=Digi-Key; Supplier Part Number 1: CAT24C512WI-GT3OSCT-ND
U2 = STM32F103RCT6TR: IC MCU STM32F103 ARM CORTEX M3 32 BIT 72MHz 256K FLASH 48K RAM LQFP-64; Manufacturer: STMicroelectronics; Interface: I2C,SPI,USB,CAN,IrDA,UART,USART,LIN; RAM Size: 48KB; Max Supply Voltage: 3.6V; Number of Timers/Counters: 8; Number of I/Os: 51; Max Power Dissipation: 444mW; Min Supply Voltage: 2V; Oscillator Type: Internal; Data Bus Width: 32b; Watchdog Timer: Yes; Memory Size: 256KB; Peripherals: POR,PWM,WDT,DMA,Temp Sensor,I2C; Supplier 1: Digi-Key; Manufacturer Part Number: STM32F103RCT6TR; Stock 1: 2139; Pricing 1: 1 = 6,37000, 10 = 5,75400, 100 = 4,76350, 500 = 4,14804 (USD); RoHS: Yes; Case/Package: LQFP; Number of Pins: 64; Contact Plating: Gold; Min Operating Temperature: -40°C; Max Operating Temperature: 85°C; Frequency: 72MHz; Package Quantity: 1000; Packaging: Tape and Reel; Number of Programmable I/O: 51; Max Frequency: 72MHz; Memory Type: FLASH; Core Architecture: ARM; Length: 10mm; Radiation Hardening: No; Lead Free: Lead Free; ComponentLink1URL: https://datasheet.ciiva.com/26816/stm32f103rct6tr-26816977.pdf?src-supplier=IIIC; ComponentLink1Description: https://datasheet.ciiva.com/26816/stm32f103rct6tr-26816977.pdf?src-supplier=IIIC; ComponentLink2URL: https://datasheet.ciiva.com/1594/cd00191185-1594721.pdf?src-supplier=Digi-Key; ComponentLink2Description: https://datasheet.ciiva.com/1594/cd00191185-1594721.pdf?src-supplier=Digi-Key; Supplier Part Number 1: 497-17384-1-ND
X1 = TSX-322516.0000MF18X-AC0: CRYSTAL 16MHZ 9PF SMD 4-SMD; Manufacturer 1: Epson; ESR (Equivalent Series Resistance): 60R; Frequency Stability: 18ppm; Supplier 1: Digi-Key; Manufacturer Part Number 1: TSX-322516.0000MF18X-AC0; Stock 1: 11995; Pricing 1: 1=0,36000, 10=0,30300, 50=0,27220, 100=0,24200, 500=0,22990 (USD); RoHS: Yes; Mount: Surface Mount; Min Operating Temperature: -20°C; Max Operating Temperature: 75°C; Packaging: Tape and Reel; Length: 0.126inch; Height: 0.024inch; Width: 0.098inch; ComponentLink1URL: https://www5.epsondevice.com/en/information/support/pdf/june_2018_psc_masterbook.pdf?src-supplier=Digi-Key; ComponentLink1Description: https://www5.epsondevice.com/en/information/support/pdf/june_2018_psc_masterbook.pdf?src-supplier=Digi-Key; ComponentLink2URL: https://www.eea.epson.com/wp-content/uploads/2016/11/November-2016-PCS-MASTER-BOOK.pdf?src-supplier=Verical; ComponentLink2Description: https://www.eea.epson.com/wp-content/uploads/2016/11/November-2016-PCS-MASTER-BOOK.pdf?src-supplier=Verical; ComponentLink3URL: https://www.eea.epson.com/wp-content/uploads/2016/11/November-2016-PCS-MASTER-BOOK.pdf?src-supplier=Mouser; ComponentLink3Description: https://www.eea.epson.com/wp-content/uploads/2016/11/November-2016-PCS-MASTER-BOOK.pdf?src-supplier=Mouser; ComponentLink4URL: https://www.eea.epson.com/wp-content/uploads/2016/11/November-2016-PCS-MASTER-BOOK.pdf?src-supplier=Dove; ComponentLink4Description: https://www.eea.epson.com/wp-content/uploads/2016/11/November-2016-PCS-MASTER-BOOK.pdf?src-supplier=Dove; Supplier Part Number 1: SER4070CT-ND
X2 = FC-13532.7680KA-A5: CRYSTAL 32.768KHZ 12.5PF SMD 2-SMD; Manufacturer: Epson; ESR (Equivalent Series Resistance): 70kR; Supplier 1: Digi-Key; Manufacturer Part Number: FC-13532.7680KA-A5; Stock 1: 86519; Pricing 1: 1 = 0,41000, 10 = 0,34400, 50 = 0,30940, 100 = 0,27500, 500 = 0,26126, 1000 = 0,22000 (USD); RoHS: Yes; Mount: Surface Mount; Number of Pins: 2; Min Operating Temperature: -40°C; Max Operating Temperature: 85°C; Packaging: Tape and Reel; Series Resistance: 70kR; Length: 0.126inch; Height: 0.035inch; Width: 0.061inch; ComponentLink1URL: https://support.epson.biz/td/api/doc_check.php?dl=brief_FC-135&lang=en&src-supplier=Digi-Key; ComponentLink1Description: https://support.epson.biz/td/api/doc_check.php?dl=brief_FC-135&lang=en&src-supplier=Digi-Key; ComponentLink2URL: https://www.eea.epson.com/wp-content/uploads/2016/11/November-2016-PCS-MASTER-BOOK.pdf?src-supplier=Digi-Key; ComponentLink2Description: https://www.eea.epson.com/wp-content/uploads/2016/11/November-2016-PCS-MASTER-BOOK.pdf?src-supplier=Digi-Key; Supplier Part Number 1: SER4103CT-ND